# EAGLE design Data_East_128x16 (EAGLE 7.4.0)
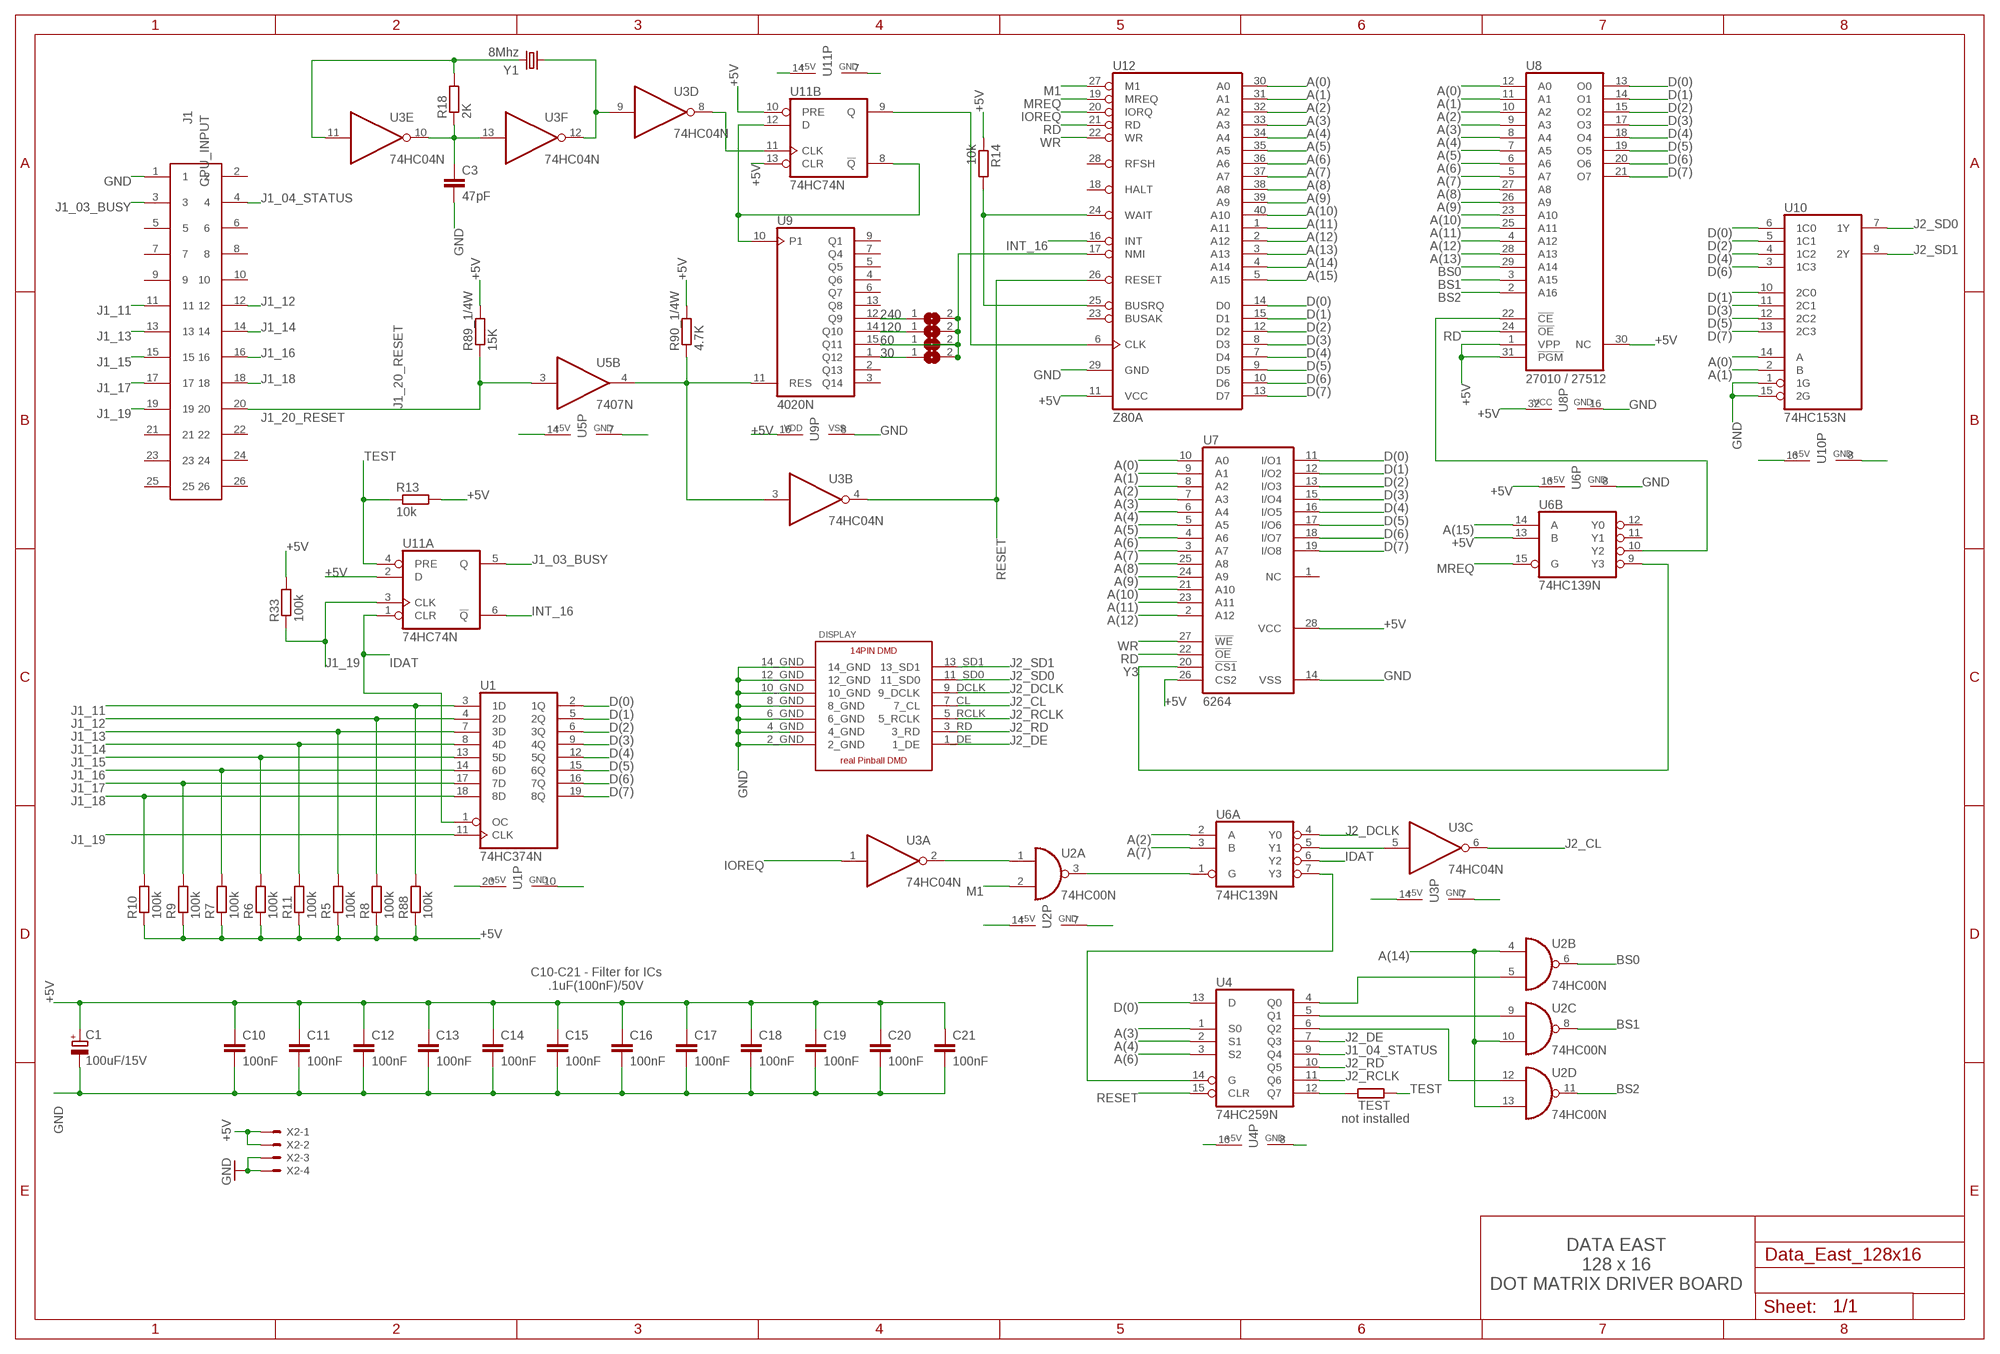
[diagram p0: schematic, sheet 1]

## Parts
C1  100uF/15V  CPOL-EUE2.5-7  [E2,5-7]
C3  47pF  C-EU050-025X075  [C050-025X075]
C10  100nF  C-EU050-025X075  [C050-025X075]
C11  100nF  C-EU050-025X075  [C050-025X075]
C12  100nF  C-EU050-025X075  [C050-025X075]
C13  100nF  C-EU050-025X075  [C050-025X075]
C14  100nF  C-EU050-025X075  [C050-025X075]
C15  100nF  C-EU050-025X075  [C050-025X075]
C16  100nF  C-EU050-025X075  [C050-025X075]
C17  100nF  C-EU050-025X075  [C050-025X075]
C18  100nF  C-EU050-025X075  [C050-025X075]
C19  100nF  C-EU050-025X075  [C050-025X075]
C20  100nF  C-EU050-025X075  [C050-025X075]
C21  100nF  C-EU050-025X075  [C050-025X075]
CPU_INPUT  J1  61202622323  [61202622323]
DISPLAY  PINBALL_DMD_HEADER_MALE  [14_PIN_DMD_MALE]
R5  100k  R-EU_0207/7  [0207/7]
R6  100k  R-EU_0207/7  [0207/7]
R7  100k  R-EU_0207/7  [0207/7]
R8  100k  R-EU_0207/7  [0207/7]
R9  100k  R-EU_0207/7  [0207/7]
R10  100k  R-EU_0207/7  [0207/7]
R11  100k  R-EU_0207/7  [0207/7]
R13  10k  R-EU_0207/7  [0207/7]
R14  10k  R-EU_0207/7  [0207/7]
R18  2K  R-EU_0207/7  [0207/7]
R33  100k  R-EU_0207/7  [0207/7]
R88  100k  R-EU_0207/7  [0207/7]
R89_1/4W  15K  R-EU_0207/7  [0207/7]
R90_1/4W  4.7K  R-EU_0207/7  [0207/7]
SJ2  SJ  [SJ]
SJ4  SJ  [SJ]
SJ5  SJ  [SJ]
SJ6  SJ  [SJ]
TEST  R-EU_0207/7  [0207/7]
U1  74HC374N  [DIL20]
U2  74HC00N  [DIL14]
U3  74HC04N  [DIL14]
U4  74HC259N  [DIL16]
U5  7407N  [DIL14]
U6  74HC139N  [DIL16]
U7  6264  6264A  [DIL28-6]
U8  27010 / 27512  27010  [DIL32]
U9  4020N  [DIL16]
U10  74HC153N  [DIL16]
U11  74HC74N  [DIL14]
U12  Z80A  Z80CPU  [DIL40]
X2  KK-156-4  [KK-156-4]
Y1  8Mhz  CRYSTALHC49U70  [HC49U70]

## Nets
30: SJ6.1 U9.1(Q12)
60: SJ2.2 SJ4.2 SJ5.1 SJ5.2 SJ6.2 U9.15(Q11) U12.17(NMI)
120: SJ4.1 U9.14(Q10)
240: SJ2.1 U9.12(Q9)
+5V: C1.+ C10.1 C11.1 C12.1 C13.1 C14.1 C15.1 C16.1 C17.1 C18.1 C19.1 C20.1 C21.1 R5.1 R6.1 R7.1 R8.1 R9.1 R10.1 R11.1 R13.2 R14.1 R33.2 R88.1 R89_1/4W.2 R90_1/4W.2 U1.20(VCC) U2.14(P:VCC) U3.14(P:VCC) U4.16(VCC) U5.14(P:VCC) U6.13(B:B) U6.16(P:VCC) U7.26(CS2) U7.28(VCC) U8.1(VPP) U8.30(NC) U8.31(!PGM) U8.32(VCC) U9.16(VDD) U10.16(VCC) U11.2(A:D) U11.10(B:PRE) U11.13(B:CLR) U11.14(P:VCC) U12.11(VCC) X2.1 X2.2
A(0): U7.10(A0) U8.12(A0) U10.14(A) U12.30(A0)
A(1): U7.9(A1) U8.11(A1) U10.2(B) U12.31(A1)
A(2): U6.2(A:A) U7.8(A2) U8.10(A2) U12.32(A2)
A(3): U4.1(S0) U7.7(A3) U8.9(A3) U12.33(A3)
A(4): U4.2(S1) U7.6(A4) U8.8(A4) U12.34(A4)
A(5): U7.5(A5) U8.7(A5) U12.35(A5)
A(6): U4.3(S2) U7.4(A6) U8.6(A6) U12.36(A6)
A(7): U6.3(A:B) U7.3(A7) U8.5(A7) U12.37(A7)
A(8): U7.25(A8) U8.27(A8) U12.38(A8)
A(9): U7.24(A9) U8.26(A9) U12.39(A9)
A(10): U7.21(A10) U8.23(A10) U12.40(A10)
A(11): U7.23(A11) U8.25(A11) U12.1(A11)
A(12): U7.2(A12) U8.4(A12) U12.2(A12)
A(13): U8.28(A13) U12.3(A13)
A(14): U2.4(B:I0) U2.10(C:I1) U2.13(D:I1) U12.4(A14)
A(15): U6.14(B:A) U12.5(A15)
BS0: U2.6(B:O) U8.29(A14)
BS1: U2.8(C:O) U8.3(A15)
BS2: U2.11(D:O) U8.2(A16)
D(0): U1.2(1Q) U4.13(D) U7.11(I/O1) U8.13(O0) U10.6(1C0) U12.14(D0)
D(1): U1.5(2Q) U7.12(I/O2) U8.14(O1) U10.10(2C0) U12.15(D1)
D(2): U1.6(3Q) U7.13(I/O3) U8.15(O2) U10.5(1C1) U12.12(D2)
D(3): U1.9(4Q) U7.15(I/O4) U8.17(O3) U10.11(2C1) U12.8(D3)
D(4): U1.12(5Q) U7.16(I/O5) U8.18(O4) U10.4(1C2) U12.7(D4)
D(5): U1.15(6Q) U7.17(I/O6) U8.19(O5) U10.12(2C2) U12.9(D5)
D(6): U1.16(7Q) U7.18(I/O7) U8.20(O6) U10.3(1C3) U12.10(D6)
D(7): U1.19(8Q) U7.19(I/O8) U8.21(O7) U10.13(2C3) U12.13(D7)
GND: C1.- C3.2 C10.2 C11.2 C12.2 C13.2 C14.2 C15.2 C16.2 C17.2 C18.2 C19.2 C20.2 C21.2 CPU_INPUT.1 DISPLAY.2_GND DISPLAY.4_GND DISPLAY.6_GND DISPLAY.8_GND DISPLAY.10_GND DISPLAY.12_GND DISPLAY.14_GND U1.10(GND) U2.7(P:GND) U3.7(P:GND) U4.8(GND) U5.7(P:GND) U6.8(P:GND) U7.14(VSS) U8.16(GND) U9.8(VSS) U10.1(1G) U10.8(GND) U10.15(2G) U11.7(P:GND) U12.29(GND) X2.3 X2.4
IDAT: U1.1(OC) U6.6(A:Y2) U11.1(A:CLR)
INT_16: U11.6(A:!Q) U12.16(INT)
IOREQ: U3.1(A:I) U12.20(IORQ)
J1_03_BUSY: CPU_INPUT.3 U11.5(A:Q)
J1_04_STATUS: CPU_INPUT.4 U4.9(Q4)
J1_11: CPU_INPUT.11 R88.2 U1.3(1D)
J1_12: CPU_INPUT.12 R8.2 U1.4(2D)
J1_13: CPU_INPUT.13 R5.2 U1.7(3D)
J1_14: CPU_INPUT.14 R11.2 U1.8(4D)
J1_15: CPU_INPUT.15 R6.2 U1.13(5D)
J1_16: CPU_INPUT.16 R7.2 U1.14(6D)
J1_17: CPU_INPUT.17 R9.2 U1.17(7D)
J1_18: CPU_INPUT.18 R10.2 U1.18(8D)
J1_19: CPU_INPUT.19 R33.1 U1.11(CLK) U11.3(A:CLK)
J1_20_RESET: CPU_INPUT.20 R89_1/4W.1 U5.3(B:I)
J2_CL: DISPLAY.7_CL U3.6(C:O)
J2_DCLK: DISPLAY.9_DCLK U6.4(A:Y0)
J2_DE: DISPLAY.1_DE U4.7(Q3)
J2_RCLK: DISPLAY.5_RCLK U4.11(Q6)
J2_RD: DISPLAY.3_RD U4.10(Q5)
J2_SD0: DISPLAY.11_SD0 U10.7(1Y)
J2_SD1: DISPLAY.13_SD1 U10.9(2Y)
M1: U2.2(A:I1) U12.27(M1)
MREQ: U6.15(B:G) U12.19(MREQ)
N$1: C3.1 R18.1 U3.10(E:O) U3.13(F:I)
N$2: R18.2 U3.11(E:I) Y1.2
N$3: U3.9(D:I) U3.12(F:O) Y1.1
N$4: TEST.2 U4.12(Q7)
N$5: U3.8(D:O) U11.11(B:CLK)
N$6: U9.10(P1) U11.8(B:!Q) U11.12(B:D)
N$7: R90_1/4W.1 U3.3(B:I) U5.4(B:O) U9.11(RES)
N$8: U11.9(B:Q) U12.6(CLK)
N$9: R14.2 U12.24(WAIT) U12.25(BUSRQ)
N$11: U3.5(C:I) U6.5(A:Y1)
N$12: U2.5(B:I1) U4.4(Q0)
N$13: U2.1(A:I0) U3.2(A:O)
N$14: U2.3(A:O) U6.1(A:G)
N$15: U2.9(C:I0) U4.5(Q1)
N$16: U4.14(G) U6.7(A:Y3)
N$18: U2.12(D:I0) U4.6(Q2)
N$35: U6.10(B:Y2) U8.22(!CE)
RD: U7.22(!OE) U8.24(!OE) U12.21(RD)
RESET: U3.4(B:O) U4.15(CLR) U12.26(RESET)
TEST: R13.1 TEST.1 U11.4(A:PRE)
WR: U7.27(!WE) U12.22(WR)
Y3: U6.9(B:Y3) U7.20(!CS1)
Unconnected: CPU_INPUT.2 CPU_INPUT.5 CPU_INPUT.6 CPU_INPUT.7 CPU_INPUT.8 CPU_INPUT.9 CPU_INPUT.10 CPU_INPUT.21 CPU_INPUT.22 CPU_INPUT.23 CPU_INPUT.24 CPU_INPUT.25 CPU_INPUT.26 U5.1(A:I) U5.2(A:O) U5.5(C:I) U5.6(C:O) U5.8(D:O) U5.9(D:I) U5.10(E:O) U5.11(E:I) U5.12(F:O) U5.13(F:I) U6.11(B:Y1) U6.12(B:Y0) U7.1(NC) U9.2(Q13) U9.3(Q14) U9.4(Q6) U9.5(Q5) U9.6(Q7) U9.7(Q4) U9.9(Q1) U9.13(Q8) U12.18(HALT) U12.23(BUSAK) U12.28(RFSH)

## Notes on the sheet
- C10-C21 - Filter for ICs
  .1uF(100nF)/50V
- not installed
- DATA EAST
  128 x 16
  DOT MATRIX DRIVER BOARD

## Library data of the parts
C1 = rcl:CPOL-EU: POLARIZED CAPACITOR, European symbol
C3 C10-C21 = resistor:C-EU: CAPACITOR, European symbol
CPU_INPUT = Wuerth_Elektronik_eiCan_05_Box_Header_IDC_Connectors_1_2:61202622323: WR-BHD 2.54mm Board to Cable Transition Connector, 26 Pins
DISPLAY = zzz_Sascha:PINBALL_DMD_HEADER: Pinball DMD Header 14PIN Created 21.10.2015 by DIY Sascha Header zum Anschluss eines Original Pinball DMD mit 14 Pins Port = HUB07 ENJOY!
R5-R11 R13 R14 R18 R33 R88 R89_1/4W R90_1/4W TEST = resistor:R-EU_: RESISTOR, European symbol
SJ2 SJ4-SJ6 = jumper:SJ: SMD solder JUMPER
U1 = 74xx-eu:74*374: Octal D type transparent LATCH, edge triggered
U2 = 74xx-eu:74*00: Quad 2-input NAND gate
U3 = 74xx-eu:74*04: Hex INVERTER
U4 = 74xx-eu:74*259: 8-bit addressable LATCH
U5 = 74xx-eu:74*07: Hex BUFFER, open collector high-voltage output
U6 = 74xx-eu:74*139: Dual 2-line to 4-line DECODER/DEMULTIPLEXER
U7 = memory-hitachi:6264A: MEMORY; OC_FARNELL: 283605; OC_NEWARK: unknown
U8 = memory:27010: MEMORY
U9 = 40xx:4020: 14-stage binary/ripple COUNTER
U10 = 74xx-eu:74*153: Dual 4-line to 1-line data SELECTOR/MULTIPLEXER
U11 = 74xx-eu:74*74: Dual D type positive edge triggered FLIP FLOP, preset and clear
U12 = zilog:Z80CPU: Z80 FAMILY DEVICE
X2 = con-molex:KK-156-4: KK 156 HEADER Source: http://www.molex.com/pdm_docs/sd/026604100_sd.pdf; OC_FARNELL: unknown; OC_NEWARK: unknown
Y1 = crystal:CRYSTAL: CRYSTAL; OC_FARNELL: unknown; OC_NEWARK: unknown

## Board
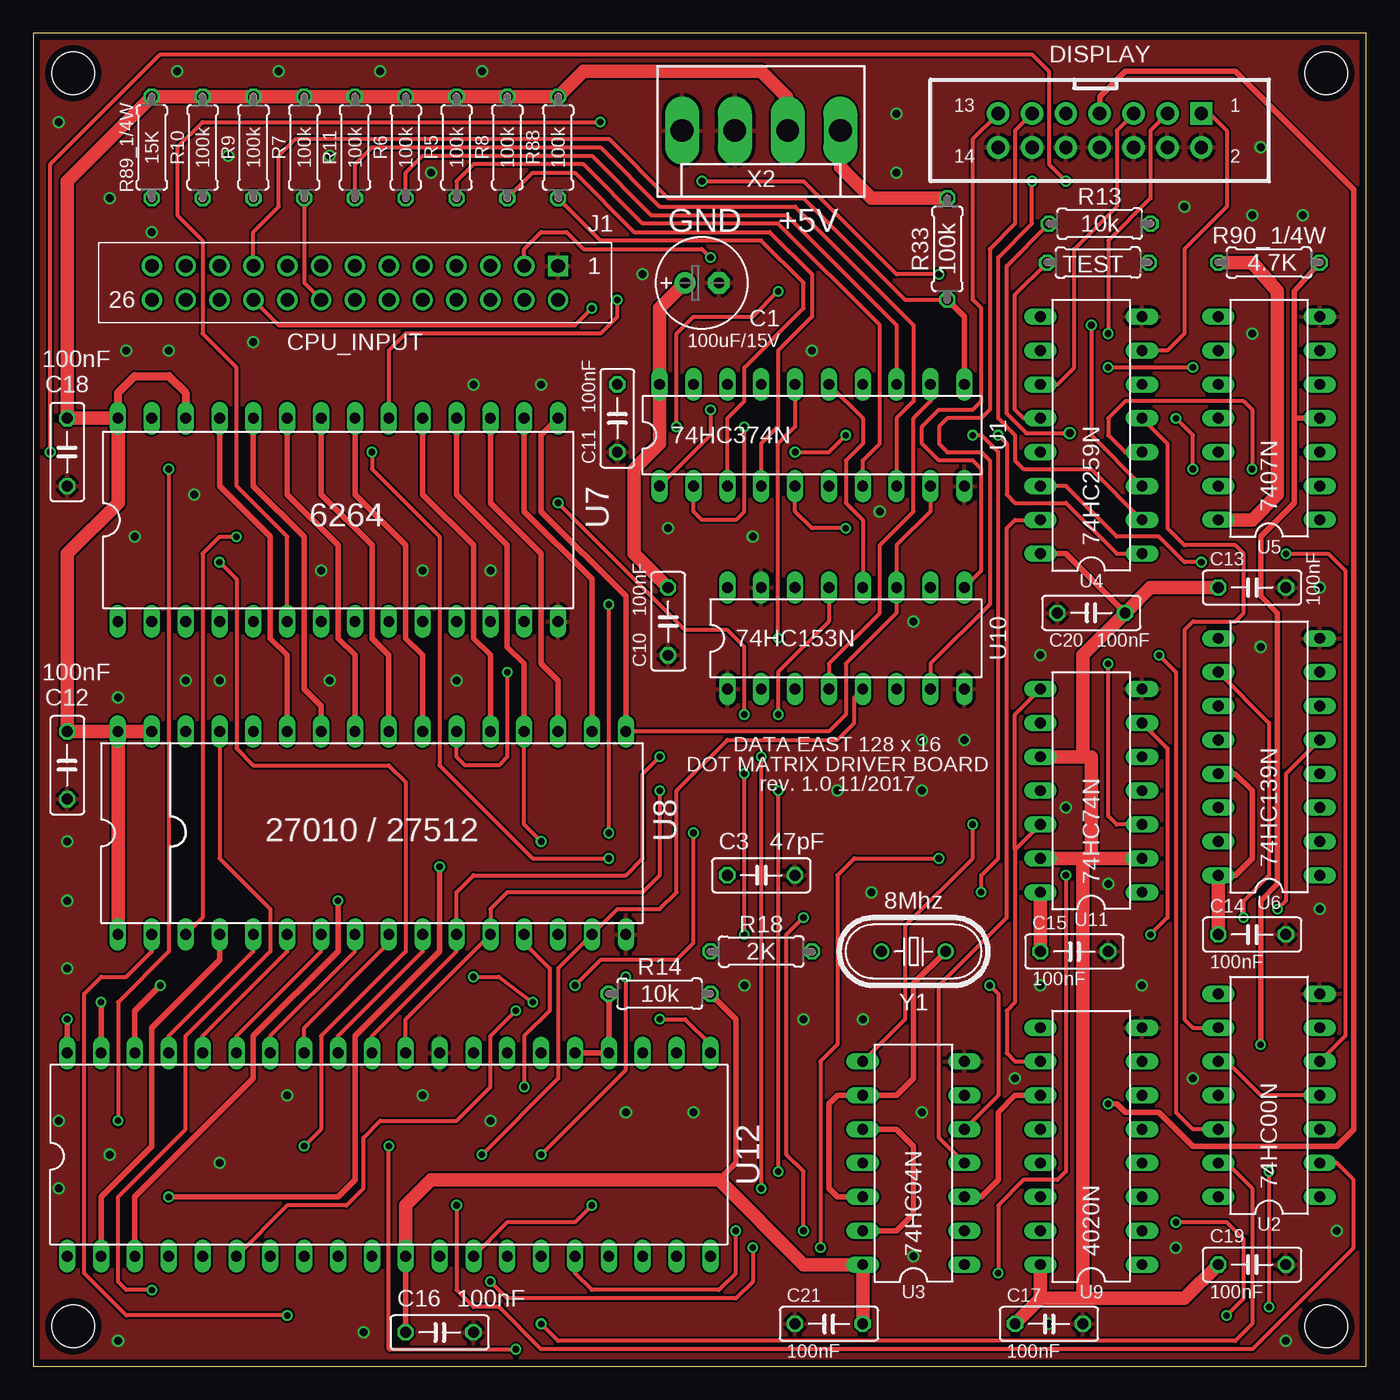
[diagram p1: board, top side]
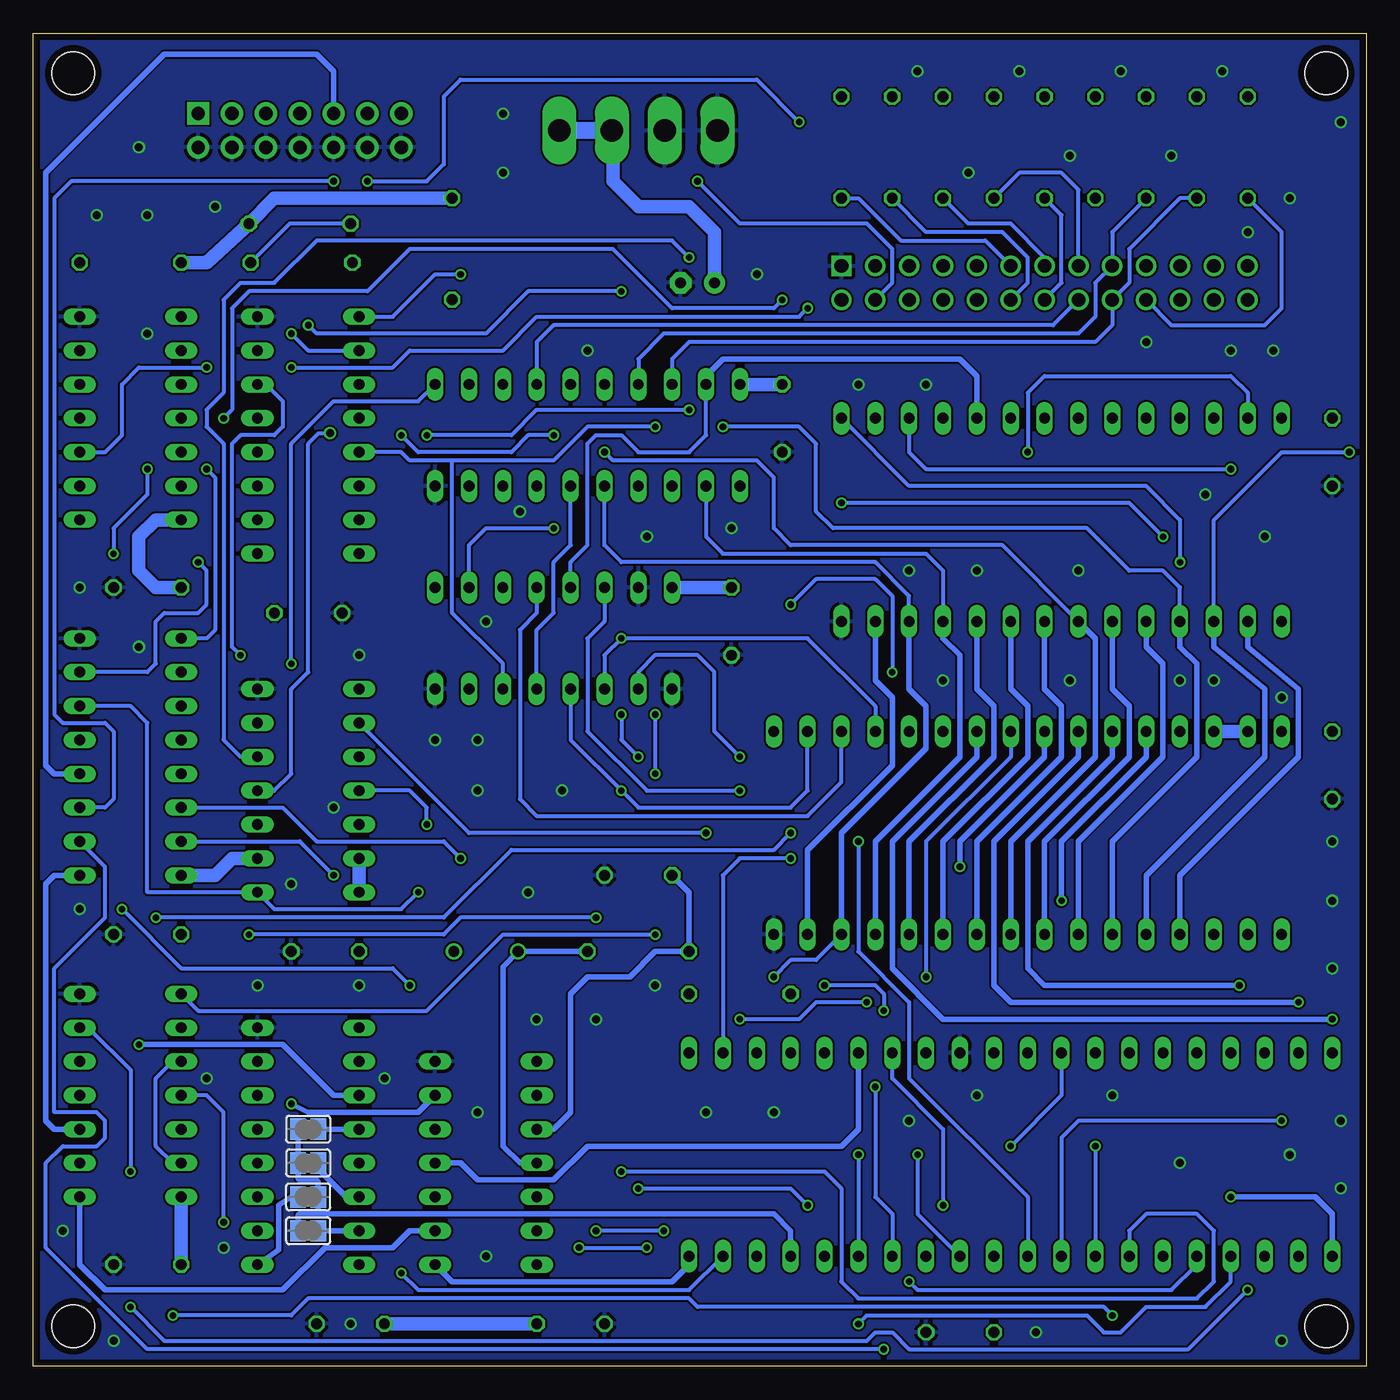
[diagram p2: board, bottom side, seen from below]

Size 100 x 100 mm. Coordinates in mm from the lower left corner, seen from the top.
Outline: 0,0 100,0 100,100 0,100 0,0
Copper layers (1*16): Top 0.035mm / dielectric 1.6mm / Bottom 0.035mm
Design rules "Elecrow_2-layer_PCB_eagle_rule_NAME": minimum track width 6mil, minimum drill 12mil, track to track 6mil, track to pad 6mil, pad to pad 6mil, via to via 8mil, smd to smd 0mil, copper to edge 20mil, drill to drill 10mil, minimum pad ring 6mil, minimum via ring 6mil, stop-mask expansion 0mil, vias tented up to drill 100mil, thermal gap 10mil
Holes 3.2 mm at 3,3 97,3 97,97 3,97

### Footprints (pad centres in the part's own frame; a part is rotated, then mirrored left to right if it is on the bottom)
E2,5-7 = drill 0.813 pad 1.6: + -1.27,0 | drill 0.813 pad 1.6 octagon: - 1.27,0
C050-025X075 = drill 0.813 octagon: 1 -2.54,0; 2 2.54,0
61202622323 = drill 1.02 square: 1 -2.54,-1.27 | drill 1.02: 2 -2.54,1.27; 3 0,-1.27; 4 0,1.27; 5 2.54,-1.27; 6 2.54,1.27; 7 5.08,-1.27; 8 5.08,1.27; 9 7.62,-1.27; 10 7.62,1.27; 11 10.16,-1.27; 12 10.16,1.27; 13 12.7,-1.27; 14 12.7,1.27; 15 15.24,-1.27; 16 15.24,1.27; 17 17.78,-1.27; 18 17.78,1.27; 19 20.32,-1.27; 20 20.32,1.27; 21 22.86,-1.27; 22 22.86,1.27; 23 25.4,-1.27; 24 25.4,1.27; 25 27.94,-1.27; 26 27.94,1.27
14_PIN_DMD_MALE = drill 1 pad 1.676 square: 1_DE 15.24,2.54 | drill 1 pad 1.676: 2_GND 15.24,0; 3_RD 12.7,2.54; 4_GND 12.7,0; 5_RCLK 10.16,2.54; 6_GND 10.16,0; 7_CL 7.62,2.54; 8_GND 7.62,0; 9_DCLK 5.08,2.54; 10_GND 5.08,0; 11_SD0 2.54,2.54; 12_GND 2.54,0; 13_SD1 0,2.54; 14_GND 0,0
0207/7 = drill 0.813 octagon: 1 -3.81,0; 2 3.81,0
SJ = smd 1.168 x 1.6: 1 -0.762,0; 2 0.762,0
DIL20 = drill 0.813 long: 1 -11.43,-3.81; 2 -8.89,-3.81; 3 -6.35,-3.81; 4 -3.81,-3.81; 5 -1.27,-3.81; 6 1.27,-3.81; 7 3.81,-3.81; 8 6.35,-3.81; 9 8.89,-3.81; 10 11.43,-3.81; 11 11.43,3.81; 12 8.89,3.81; 13 6.35,3.81; 14 3.81,3.81; 15 1.27,3.81; 16 -1.27,3.81; 17 -3.81,3.81; 18 -6.35,3.81; 19 -8.89,3.81; 20 -11.43,3.81
DIL14 = drill 0.813 long: 1 -7.62,-3.81; 2 -5.08,-3.81; 3 -2.54,-3.81; 4 0,-3.81; 5 2.54,-3.81; 6 5.08,-3.81; 7 7.62,-3.81; 8 7.62,3.81; 9 5.08,3.81; 10 2.54,3.81; 11 0,3.81; 12 -2.54,3.81; 13 -5.08,3.81; 14 -7.62,3.81
DIL16 = drill 0.813 long: 1 -8.89,-3.81; 2 -6.35,-3.81; 3 -3.81,-3.81; 4 -1.27,-3.81; 5 1.27,-3.81; 6 3.81,-3.81; 7 6.35,-3.81; 8 8.89,-3.81; 9 8.89,3.81; 10 6.35,3.81; 11 3.81,3.81; 12 1.27,3.81; 13 -1.27,3.81; 14 -3.81,3.81; 15 -6.35,3.81; 16 -8.89,3.81
DIL28-6 = drill 0.813 long: 1 -16.51,-7.62; 2 -13.97,-7.62; 3 -11.43,-7.62; 4 -8.89,-7.62; 5 -6.35,-7.62; 6 -3.81,-7.62; 7 -1.27,-7.62; 8 1.27,-7.62; 9 3.81,-7.62; 10 6.35,-7.62; 11 8.89,-7.62; 12 11.43,-7.62; 13 13.97,-7.62; 14 16.51,-7.62; 15 16.51,7.62; 16 13.97,7.62; 17 11.43,7.62; 18 8.89,7.62; 19 6.35,7.62; 20 3.81,7.62; 21 1.27,7.62; 22 -1.27,7.62; 23 -3.81,7.62; 24 -6.35,7.62; 25 -8.89,7.62; 26 -11.43,7.62; 27 -13.97,7.62; 28 -16.51,7.62
DIL32 = drill 0.813 long: 1 -19.05,-7.62; 2 -16.51,-7.62; 3 -13.97,-7.62; 4 -11.43,-7.62; 5 -8.89,-7.62; 6 -6.35,-7.62; 7 -3.81,-7.62; 8 -1.27,-7.62; 9 1.27,-7.62; 10 3.81,-7.62; 11 6.35,-7.62; 12 8.89,-7.62; 13 11.43,-7.62; 14 13.97,-7.62; 15 16.51,-7.62; 16 19.05,-7.62; 17 19.05,7.62; 18 16.51,7.62; 19 13.97,7.62; 20 11.43,7.62; 21 8.89,7.62; 22 6.35,7.62; 23 3.81,7.62; 24 1.27,7.62; 25 -1.27,7.62; 26 -3.81,7.62; 27 -6.35,7.62; 28 -8.89,7.62; 29 -11.43,7.62; 30 -13.97,7.62; 31 -16.51,7.62; 32 -19.05,7.62
DIL40 = drill 0.813 long: 1 -24.13,-7.62; 2 -21.59,-7.62; 3 -19.05,-7.62; 4 -16.51,-7.62; 5 -13.97,-7.62; 6 -11.43,-7.62; 7 -8.89,-7.62; 8 -6.35,-7.62; 9 -3.81,-7.62; 10 -1.27,-7.62; 11 1.27,-7.62; 12 3.81,-7.62; 13 6.35,-7.62; 14 8.89,-7.62; 15 11.43,-7.62; 16 13.97,-7.62; 17 16.51,-7.62; 18 19.05,-7.62; 19 21.59,-7.62; 20 24.13,-7.62; 21 24.13,7.62; 22 21.59,7.62; 23 19.05,7.62; 24 16.51,7.62; 25 13.97,7.62; 26 11.43,7.62; 27 8.89,7.62; 28 6.35,7.62; 29 3.81,7.62; 30 1.27,7.62; 31 -1.27,7.62; 32 -3.81,7.62; 33 -6.35,7.62; 34 -8.89,7.62; 35 -11.43,7.62; 36 -13.97,7.62; 37 -16.51,7.62; 38 -19.05,7.62; 39 -21.59,7.62; 40 -24.13,7.62
KK-156-4 = drill 1.7 pad 2.184 long: 1 -5.94,0; 2 -1.98,0; 3 1.98,0; 4 5.94,0
HC49U70 = drill 0.813: 1 -2.413,0; 2 2.413,0

### Placement (x,y rotation side)
C1  50.16,81.28 0 top
C3  54.61,36.83 0 top
C10  47.62,55.88 270 top
C11  43.81,71.12 270 top
C12  2.54,45.09 270 top
C13  91.44,58.42 0 top
C14  91.44,32.38 0 top
C15  78.11,31.11 0 top
C16  30.48,2.54 0 top
C17  76.2,3.17 0 top
C18  2.54,68.58 270 top
C19  91.44,7.62 0 top
C20  79.38,56.52 180 top
C21  59.69,3.17 180 top
CPU_INPUT  36.83,81.28 180 top
DISPLAY  72.39,91.44 0 top
R5  31.75,91.44 270 top
R6  27.94,91.44 270 top
R7  20.32,91.44 270 top
R8  35.56,91.44 270 top
R9  16.51,91.44 270 top
R10  12.7,91.44 270 top
R11  24.13,91.44 270 top
R13  80.01,85.72 0 top
R14  46.99,27.94 180 top
R18  54.61,31.11 0 top
R33  68.58,83.82 90 top
R88  39.37,91.44 270 top
R89_1/4W  8.89,91.44 90 top
R90_1/4W  92.71,82.8 180 top
SJ2  79.38,17.78 180 bottom
SJ4  79.38,15.24 180 bottom
SJ5  79.38,10.16 0 bottom
SJ6  79.38,12.7 0 bottom
TEST  79.88,82.8 180 top
U1  58.42,69.85 0 top
U2  92.71,20.32 90 top
U3  66.04,15.24 90 top
U4  79.38,69.85 90 top
U5  92.71,71.12 90 top
U6  92.71,45.72 90 top
U7  22.86,63.5 0 top
U8  25.4,40.01 0 top
U9  79.38,16.51 90 top
U10  60.96,54.61 0 top
U11  79.38,43.18 90 top
U12  26.67,15.88 0 top
X2  54.61,92.71 180 top
Y1  66.04,31.11 180 top

### Tracks (layer width: path | path; a pad name or v marks a point on that pad's centre or on a via)
30
  Bottom 0.406: SJ6.1 80.64,12.7 81.6,12.06 81.6,8.73 U9.1
60
  Bottom 0.406: U12.17 43.18,10.16 44.45,11.43 78.74,11.43 | 78.74,11.43 80.01,11.43 80.14,11.3 SJ5.1 SJ5.2 U9.15 | SJ2.2 SJ4.2 80.14,14.1 80.01,13.97 78.74,13.97 78.61,13.84 SJ6.2 78.61,11.56 78.74,11.43
120
  Bottom 0.406: U9.14 76.52,12.7 78.58,14.76 78.58,15.21 SJ4.1
240
  Bottom 0.406: SJ2.1 U9.12
+5V
  Top 0.406: C16.1 U12.11 | U4.16 77.47,60.96 C20.1 | U6.16 90.17,36.83 91.44,38.1 91.44,43.18 90.17,44.45 U6.13 | R14.1 52.7,26.04 52.7,15.24 51.44,13.97
  Top 0.61: U7.28 6.35,73.03 7.62,74.3 10.16,74.3 11.43,73.03 U7.26
  Top 1.016: U8.32 C12.1 2.54,60.96 6.35,64.77 U7.28 C18.1 2.54,88.9 R89_1/4W.2 R10.1 R9.1 R7.1 R11.1 R6.1 R5.1 R8.1 R88.1 41.27,97.16 54.61,97.16 56.52,95.25 56.52,92.78 X2.2 | U8.32 U8.1 | U8.32 U8.31 | R33.2 62.87,87.63 60.55,89.94 X2.1 | C1.+ 46.99,79.38 U1.20 46.99,69.22 45.09,67.31 45.09,60.96 C10.1 | U12.11 27.94,12.06 29.84,13.97 51.44,13.97 57.78,7.62 U3.14 C21.1 | C17.1 75.56,5.08 | 75.56,5.08 U9.16 | C19.1 86.36,5.08 78.74,5.08 | 78.74,5.08 75.56,5.08 | C15.1 U11.14 | U11.2 79.38,38.1 | 78.74,38.1 U11.13 | C14.1 U6.16 | U11.10 78.74,45.72 | 79.38,38.1 79.38,45.72 78.74,45.72 | 79.38,38.1 78.74,38.1 | 78.74,45.72 78.74,53.34 C20.1 83.82,58.42 C13.1 | U5.14 91.44,63.5 93.34,65.41 93.34,80.64 91.44,82.8 R90_1/4W.2 | 78.74,38.1 78.74,5.08
  Bottom 1.016: C11.1 U1.20 | C10.1 U10.16 | C21.1 C17.1 | C19.1 U2.14 | U11.13 U11.14 | C13.1 90.81,58.42 92.08,59.69 92.08,62.23 90.81,63.5 U5.14 | R33.2 81.92,87.63 R13.2 87,82.8 R90_1/4W.2 | U11.2 85.09,38.1 86.36,36.83 U6.16 | C1.+ 48.9,85.09 50.8,87 54.61,87 56.52,88.9 56.52,92.64 X2.2 | U8.31 U8.30
  Bottom 1.27: X2.2 X2.1
A(0)  (via drill 0.5)
  Top 0.305: v46.99,43.18 46.99,36.83 45.72,35.56 35.56,35.56 34.29,34.29 U8.12 27.94,26.04 U12.30
  Bottom 0.305: U10.14 57.15,55.88 58.42,54.61 58.42,47.62 53.98,43.18 v46.99,43.18
  Bottom 0.406: U8.12 34.29,39.37 27.94,45.72 27.94,49.53 29.21,50.8 U7.10
A(1)  (via drill 0.5)
  Top 0.305: v46.99,45.72 45.72,44.45 45.72,38.1 44.45,36.83 33.02,36.83 31.75,35.56 U8.11 31.75,31.11 25.4,24.77 U12.31
  Bottom 0.305: U10.2 54.61,52.07 53.34,53.34 50.16,53.34 48.9,52.07 48.9,47.62 v46.99,45.72
  Bottom 0.406: U8.11 31.75,39.37 25.4,45.72 25.4,49.53 26.67,50.8 U7.9
A(2)  (via drill 0.5)
  Top 0.305: v36.2,1.27 26.67,1.27 v26.67,16.51 | U12.32 22.86,24.77 29.21,31.11 U8.10
  Bottom 0.305: U6.2 94.61,37.47 94.61,33.66 98.42,29.84 98.42,19.05 95.25,19.05 94.61,18.41 94.61,17.14 95.25,16.51 97.79,16.51 99.06,15.24 99.06,8.89 91.44,1.27 v36.2,1.27 | U12.32 22.86,20.32 v26.67,16.51
  Bottom 0.406: U8.10 29.21,39.37 22.86,45.72 22.86,49.53 24.13,50.8 U7.8
A(3)  (via drill 0.5)
  Top 0.305: v57.15,68.58 59.69,68.58 v60.96,69.85 | v72.39,69.85 73.03,69.22 73.03,65.41 73.66,64.77 77.47,64.77 81.28,60.96 U4.1 | U12.33 20.32,25.4 26.67,31.75 U8.9
  Bottom 0.305: v57.15,68.58 56.52,67.94 45.72,67.94 44.45,66.67 44.45,62.87 43.18,61.59 27.3,61.59 U7.7 | v60.96,69.85 62.87,69.85 64.14,68.58 71.12,68.58 v72.39,69.85
  Bottom 0.406: U8.9 26.67,39.37 20.32,45.72 20.32,54.61 U7.7
A(4)  (via drill 0.5)
  Top 0.305: U4.2 79.38,67.31 74.3,67.31 73.66,67.94 73.66,69.85 72.39,71.12 72.39,83.19 74.93,85.72 v74.93,88.9 | U7.6 19.05,62.23 15.24,66.04 15.24,74.93 12.7,77.47 12.7,84.45 10.79,86.36 10.79,91.44 12.7,93.34 v42.55,93.34 | U12.34 17.78,24.77 24.13,31.11 U8.8
  Bottom 0.305: v42.55,93.34 45.72,96.52 67.94,96.52 69.22,95.25 69.22,90.17 70.48,88.9 v74.93,88.9
  Bottom 0.406: U7.6 19.05,50.8 17.78,49.53 17.78,45.72 24.13,39.37 U8.8
A(5)
  Top 0.305: U12.35 15.24,24.77 21.59,31.11 U8.7
  Bottom 0.406: U7.5 16.51,53.98 15.24,52.7 15.24,45.72 21.59,39.37 U8.7
A(6)  (via drill 0.5)
  Top 0.305: U4.3 79.38,69.85 v79.38,78.11 | v48.26,70.48 48.26,77.47 49.53,78.74 53.98,78.74 v55.88,80.64 | U12.36 12.7,24.77 19.05,31.11 U8.6
  Bottom 0.305: U7.4 13.97,58.42 15.24,59.69 17.78,59.69 20.95,62.87 40.01,62.87 41.27,64.14 41.27,69.22 42.55,70.48 v48.26,70.48 | v55.88,80.64 62.87,80.64 66.04,77.47 78.74,77.47 v79.38,78.11
  Bottom 0.406: U7.4 13.97,53.98 12.7,52.7 12.7,45.72 19.05,39.37 U8.6
A(7)  (via drill 0.5)
  Top 0.305: v77.47,88.9 76.2,90.17 76.2,97.16 74.93,98.42 9.53,98.42 1.27,90.17 v1.27,68.58 | U12.37 10.16,24.77 16.51,31.11 U8.5
  Bottom 0.305: U6.3 94.61,41.91 93.98,42.55 93.98,47.62 94.61,48.26 97.79,48.26 98.42,48.9 98.42,87.63 97.16,88.9 v77.47,88.9 | U7.3 11.43,63.5 6.35,68.58 v1.27,68.58
  Bottom 0.406: U7.3 11.43,53.98 7.62,50.8 7.62,45.72 16.51,36.83 U8.5
A(8)  (via drill 0.5)
  Top 0.406: U8.27 19.05,53.34 17.78,54.61 17.78,62.23 13.97,66.04 U7.25 | U12.38 7.62,26.67 v9.53,28.57
  Bottom 0.406: U8.27 19.05,45.72 25.4,39.37 25.4,29.84 24.13,28.57 v9.53,28.57
A(9)  (via drill 0.5)
  Top 0.406: U7.24 16.51,66.04 20.32,62.23 20.32,50.8 21.59,49.53 U8.26 | U12.39 v5.08,27.3
  Bottom 0.406: U8.26 21.59,45.72 27.94,39.37 27.94,28.57 26.67,27.3 v5.08,27.3
A(10)  (via drill 0.5)
  Top 0.406: U7.21 24.13,65.41 27.94,61.59 27.94,54.61 29.21,53.34 U8.23 | U12.40 v2.54,26.04
  Bottom 0.406: U8.23 29.21,45.72 35.56,39.37 35.56,29.84 31.75,26.04 v2.54,26.04
A(11)  (via drill 0.5)
  Top 0.406: U7.23 19.05,65.41 22.86,61.59 22.86,54.61 24.13,53.34 U8.25 | v30.48,37.47 30.48,31.11 24.13,24.77 24.13,13.97 22.86,12.7 v10.16,12.7
  Bottom 0.406: U8.25 24.13,45.72 30.48,39.37 v30.48,37.47 | v10.16,12.7 3.81,12.7 2.54,11.43 U12.1
A(12)
  Top 0.406: U12.2 5.08,12.7 8.89,16.51 8.89,25.4 13.97,30.48 U8.4
  Bottom 0.406: U7.2 8.89,53.98 5.08,50.8 5.08,45.72 13.97,36.83 U8.4
A(13)  (via drill 0.5)
  Top 0.406: U12.3 7.62,12.7 16.51,21.59 16.51,24.77 22.86,31.11 v22.86,34.92
  Bottom 0.406: U8.28 16.51,45.72 22.86,39.37 v22.86,34.92
A(14)  (via drill 0.5)
  Top 0.305: v38.1,3.17 39.37,1.91 90.17,1.91 91.44,3.17 91.44,13.34 89.53,15.24 U2.13 | U2.4 92.08,20.32 89.53,22.86 U2.10
  Bottom 0.305: v38.1,3.17 37.47,3.81 20.95,3.81 19.68,2.54 18.41,2.54 16.51,4.45 12.06,4.45 10.16,6.35 U12.4 | U2.13 89.53,15.24 90.81,16.51 90.81,21.59 89.53,22.86 U2.10
A(15)  (via drill 0.5)
  Top 0.305: v34.29,6.35 35.56,5.08 52.7,5.08 53.98,6.35 v53.98,8.89 | v59.05,8.89 59.05,22.86 60.33,24.13 60.33,36.83 61.59,38.1 v67.94,38.1
  Bottom 0.305: U12.5 12.7,7.62 14.61,5.71 33.66,5.71 v34.29,6.35 | v59.05,8.89 v53.98,8.89 | U6.14 81.28,41.91 78.74,39.37 69.22,39.37 v67.94,38.1
BS0  (via drill 0.5)
  Top 0.305: v8.89,5.71 6.99,5.71 6.35,6.35 6.35,12.7 11.43,17.78 11.43,24.77 17.78,31.11 17.78,34.29 13.97,38.1 U8.29 | v92.71,14.61 v92.71,4.45
  Bottom 0.305: v8.89,5.71 13.34,1.27 34.29,1.27 35.56,2.54 36.83,2.54 37.47,1.91 90.17,1.91 v92.71,4.45 | U2.6 95.89,25.4 92.71,22.23 v92.71,14.61
BS1  (via drill 0.5)
  Top 0.305: U8.3 12.7,33.66 12.7,60.96 13.97,62.23 v15.24,62.23 | v39.37,64.77 48.9,55.24 52.07,55.24 53.34,53.98 v53.34,48.9 | v53.34,32.38 v53.34,44.45
  Bottom 0.305: U2.8 87.63,26.67 70.48,26.67 64.77,32.38 v53.34,32.38 | v39.37,64.77 17.78,64.77 v15.24,62.23 | v53.34,48.9 v53.34,44.45
BS2  (via drill 0.5)
  Top 0.305: v19.05,3.81 6.99,3.81 3.81,6.99 3.81,27.94 5.08,29.21 6.99,29.21 8.89,31.11 U8.2 | v89.53,3.81 90.81,5.08 90.81,9.53 89.53,10.79 v85.72,10.79
  Bottom 0.305: v19.05,3.81 19.68,4.45 50.16,4.45 50.8,5.08 79.38,5.08 80.64,3.81 v89.53,3.81 | U2.11 87,20.32 85.72,19.05 v85.72,10.79
D(0)  (via drill 0.5)
  Top 0.305: U8.13 36.83,31.75 38.73,29.84 38.73,26.67 36.83,24.77 v36.83,20.95 | v53.34,70.48 53.34,64.14 52.7,63.5 50.16,63.5 49.53,64.14 U1.2
  Bottom 0.305: U10.6 64.77,52.7 68.58,56.52 68.58,67.94 | U1.2 49.53,62.23 48.26,60.96 33.02,60.96 31.75,59.69 U7.11 | v36.83,20.95 36.83,12.7 35.56,11.43 U12.14 | v53.34,70.48 58.42,70.48 60.96,67.94 68.58,67.94 | 68.58,67.94 71.75,67.94 72.39,68.58 U4.13
  Bottom 0.406: U8.13 36.83,39.37 30.48,45.72 30.48,53.34 31.75,54.61 U7.11
D(1)  (via drill 0.5)
  Top 0.305: v60.96,62.87 58.42,62.87 57.15,64.14 U1.5 | v38.1,15.88 44.45,22.23 v44.45,29.21
  Bottom 0.305: U7.12 34.29,57.78 36.83,60.33 55.88,60.33 57.15,61.59 U1.5 | U10.10 67.31,61.59 66.04,62.87 v60.96,62.87 | v38.1,15.88 U12.15 | U8.14 41.27,30.48 43.18,30.48 v44.45,29.21
  Bottom 0.406: U8.14 39.37,40.01 33.02,46.35 33.02,49.53 34.29,50.8 U7.12
D(2)  (via drill 0.5)
  Top 0.305: U10.5 61.59,50.16 61.59,48.26 60.33,46.99 52.07,46.99 48.26,43.18 48.26,35.56 46.99,34.29 43.81,34.29 U8.15 39.37,29.84 39.37,21.59 v33.66,15.88
  Bottom 0.305: U10.5 62.23,55.24 60.96,56.52 60.96,60.33 59.69,61.59 U1.6 | U12.12 33.66,11.43 v33.66,15.88
  Bottom 0.406: U8.15 41.91,38.73 35.56,45.09 35.56,50.16 36.83,51.44 U7.13
D(3)  (via drill 0.5)
  Top 0.305: U1.9 67.31,64.14 64.77,61.59 U10.11 64.77,56.52 60.96,52.7 60.96,48.9 59.69,47.62 U8.17 | v20.32,16.51 21.59,17.78 21.59,24.77 27.94,31.11 27.94,43.81 26.67,45.09 16.51,45.09 15.24,46.35 15.24,59.05 v13.97,60.33
  Top 0.406: U7.15 38.1,69.85 38.1,64.14 44.45,57.78 U8.17
  Bottom 0.305: v20.32,16.51 U12.8 | U7.15 34.29,66.04 16.51,66.04 13.97,63.5 v13.97,60.33
D(4)  (via drill 0.5)
  Top 0.305: U1.12 67.31,72.39 66.04,71.12 66.04,64.14 63.5,61.59 63.5,56.52 59.69,52.7 U10.4 | v55.88,43.18 v55.88,14.61
  Top 0.406: U7.16 36.83,64.14 41.91,59.05 U8.18
  Bottom 0.305: U10.4 59.69,46.99 v55.88,43.18 54.61,41.91 43.18,41.91 41.91,43.18 U8.18 | v55.88,14.61 40.64,14.61 39.37,13.34 39.37,6.35 38.1,5.08 12.7,5.08 11.43,6.35 11.43,10.16 12.7,11.43 16.51,11.43 17.78,10.16 U12.7
D(5)  (via drill 0.5)
  Top 0.305: U1.15 62.23,71.12 62.23,69.22 60.96,67.94 60.96,64.77 62.23,63.5 U10.12 | v6.35,18.41 6.35,27.3 10.16,31.11 v10.16,67.31
  Top 0.406: U7.17 34.29,64.77 38.1,60.96 38.1,52.7 39.37,51.44 U8.19
  Bottom 0.305: U10.12 62.23,56.52 63.5,55.24 63.5,42.55 62.23,41.27 41.91,41.27 39.37,43.81 U8.19 | U12.9 22.86,17.14 21.59,18.41 v6.35,18.41 | U7.17 34.29,68.58 33.02,67.31 v10.16,67.31
D(6)  (via drill 0.5)
  Top 0.305: U1.16 57.15,70.48 55.88,69.22 v55.88,54.61 | v38.1,39.37 36.83,40.64 U8.20
  Top 0.406: U7.18 31.75,65.41 35.56,61.59 35.56,53.98 36.83,52.7 U8.20
  Bottom 0.305: v38.1,39.37 38.1,31.11 34.29,27.3 34.29,21.59 25.4,12.7 U12.10 | U8.20 36.83,49.53 41.91,54.61 v55.88,54.61 57.15,53.34 U10.3
D(7)  (via drill 0.5)
  Top 0.305: U12.13 35.56,10.79 40.64,10.79 v41.91,12.06 | U10.13 59.69,55.88 55.88,52.07 v55.88,48.9 | v54.61,45.72 v54.61,13.34
  Top 0.406: U7.19 29.21,65.41 33.02,61.59 33.02,54.61 34.29,53.34 U8.21
  Bottom 0.305: U10.13 59.69,60.33 58.42,61.59 58.42,69.22 57.78,69.85 55.88,69.85 54.61,68.58 50.8,68.58 49.53,69.85 U1.19 | v41.91,12.06 43.18,13.34 v54.61,13.34 | v55.88,48.9 55.88,46.99 v54.61,45.72
  Bottom 0.406: U7.19 29.21,74.3 30.48,75.56 48.26,75.56 49.53,74.3 U1.19
GND  (via drill 0.6)
  other vias: 19.05,20.32 5.71,15.88 2.54,34.92 6.35,50.16 1.91,93.34 53.34,28.57 49.53,19.05 34.29,18.41 29.21,20.32 62.87,35.56 66.67,43.18 95.25,86.36 86.36,87 63.5,64.14 66.67,46.99 92.08,91.44 64.77,89.53 60.33,43.18 66.04,55.88 38.1,73.66 12.06,65.41 21.59,59.69 16.51,76.83 47.62,62.87 75.56,53.34 58.42,76.2 45.72,81.92 6.99,76.2 5.71,87.63 2.54,29.84 14.61,90.81 64.77,93.98 92.08,53.98 69.85,46.99 96.52,58.42 80.64,36.2 57.78,26.04 62.23,26.04 66.67,19.05 66.04,8.26 44.45,19.05 97.79,10.16 87,21.59 83.19,28.57 77.47,41.91 85.72,8.89 76.2,3.17 96.52,34.29 22.23,90.81 29.84,89.53 10.79,97.16 18.41,97.16 26.04,97.16 33.66,97.16 2.54,39.37 91.44,86.36 91.44,77.47 13.97,15.24 53.98,62.23 13.97,51.44 29.21,59.69 34.29,59.69 31.75,51.44 22.23,51.44 11.43,51.44 93.98,1.91 6.35,1.91 1.91,18.41 1.91,13.34 7.62,62.23 33.02,73.66 10.16,76.2 8.89,85.09 24.77,2.54 75.56,28.57 73.66,21.59
  pour Top: -0.64,100.33 100.33,100.33 100.97,-0.64 -0.64,-0.64
  pour Bottom: -0.64,100.33 100.33,100.33 100.97,-0.64 -0.64,-0.64
IDAT  (via drill 0.5)
  Top 0.305: v50.8,71.75 50.8,69.85 U1.1 | v71.12,35.56 71.12,36.83 72.39,38.1 72.39,68.58 71.12,69.85 v70.48,69.85
  Bottom 0.305: v50.8,71.75 62.23,71.75 64.14,69.85 v70.48,69.85 | U6.6 92.71,49.53 91.44,48.26 91.44,35.56 U11.1 81.92,34.29 72.39,34.29 v71.12,35.56
INT_16  (via drill 0.5)
  Top 0.305: U12.16 40.64,6.99 41.91,5.71 51.44,5.71 52.7,6.99 v52.7,10.16 | U11.6 85.09,46.35 85.09,33.66 v83.82,32.38 | v57.78,10.16 57.78,14.61 56.52,15.88 56.52,32.38 v57.78,33.66
  Bottom 0.305: v52.7,10.16 v57.78,10.16 | v57.78,33.66 67.94,33.66 69.22,32.38 v83.82,32.38
IOREQ
  Bottom 0.406: U3.1 68.58,6.35 52.07,6.35 50.8,7.62 U12.20
J1_03_BUSY  (via drill 0.5)
  Top 0.305: CPU_INPUT.3 36.83,83.82 38.1,85.09 40.01,85.09 41.27,83.82 50.16,83.82 v50.8,83.19
  Bottom 0.305: v50.8,83.19 52.07,84.45 78.74,84.45 81.92,81.28 84.45,81.28 85.72,80.01 85.72,73.03 87,71.75 87,70.48 85.72,69.22 85.72,46.99 84.45,45.72 U11.5
J1_04_STATUS  (via drill 0.5)
  Top 0.305: v67.94,81.92 64.77,81.92 57.78,88.9 v50.16,88.9
  Bottom 0.305: U4.9 73.03,78.74 69.85,81.92 v67.94,81.92 | v50.16,88.9 46.99,85.72 37.47,85.72 35.56,83.82 35.56,81.28 CPU_INPUT.4
J1_11
  Top 0.305: U1.3 52.07,71.12 53.34,72.39 53.34,74.93 57.78,79.38 57.78,81.28 54.61,84.45 42.55,84.45 R88.2
  Bottom 0.305: R88.2 38.1,87.63 34.92,84.45 28.57,84.45 CPU_INPUT.11
J1_12
  Top 0.305: R8.2 37.47,89.53 40.64,89.53 45.09,85.09 55.24,85.09 58.42,81.92 58.42,78.74 55.88,76.2 55.88,70.48 54.61,69.22 U1.4
  Bottom 0.305: CPU_INPUT.12 25.4,81.28 25.4,83.19 27.3,85.09 33.02,85.09 R8.2
J1_13
  Top 0.305: U1.7 62.23,67.94 63.5,69.22 63.5,78.11 55.88,85.72 45.72,85.72 41.27,90.17 33.02,90.17 31.75,88.9 R5.2
  Bottom 0.305: CPU_INPUT.13 24.13,83.19 26.67,85.72 29.84,85.72 R5.2
J1_14
  Top 0.305: R11.2 24.13,90.17 25.4,91.44 42.55,91.44 46.99,87 57.15,87 66.04,78.11 66.04,72.39 64.77,71.12 U1.8
  Bottom 0.305: CPU_INPUT.14 22.86,81.28 22.86,86.36 R11.2
J1_15
  Top 0.305: R6.2 27.94,89.53 29.21,90.81 41.91,90.81 46.35,86.36 56.52,86.36 64.77,78.11 U1.13
  Bottom 0.305: CPU_INPUT.15 21.59,88.27 22.86,89.53 26.04,89.53 R6.2
J1_16
  Top 0.305: R7.2 20.32,81.28 CPU_INPUT.16
  Bottom 0.305: CPU_INPUT.16 23.5,78.11 60.96,78.11 62.23,76.83 U1.14
J1_17
  Bottom 0.305: R9.2 19.05,85.09 CPU_INPUT.17 20.32,81.28 20.32,78.74 21.59,77.47 52.7,77.47 54.61,75.56 U1.17
J1_18
  Bottom 0.305: R10.2 13.97,87.63 17.78,83.82 17.78,81.28 CPU_INPUT.18 19.05,78.11 20.32,76.83 50.8,76.83 52.07,75.56 U1.18
J1_19  (via drill 0.5)
  Top 0.305: U11.3 81.28,40.64 80.64,41.27 v80.64,52.7 | CPU_INPUT.19 16.51,85.09 18.41,87 18.41,90.81 19.68,92.08 43.18,92.08 47.62,87.63 57.78,87.63 65.41,80.01 R33.1
  Top 0.406: U1.11 69.85,78.74 R33.1
  Bottom 0.305: v80.64,52.7 80.64,69.22 77.47,72.39 71.12,72.39 U1.11
J1_20_RESET  (via drill 0.5)
  Top 0.305: v87,74.93 v80.64,74.93 | CPU_INPUT.20 18.41,78.11 40.64,78.11 v41.91,79.38
  Bottom 0.305: U5.3 94.61,68.58 93.34,69.85 93.34,73.66 92.08,74.93 v87,74.93 | v80.64,74.93 73.03,74.93 71.75,76.2 64.77,76.2 62.23,78.74 42.55,78.74 v41.91,79.38 | CPU_INPUT.20 14.61,78.11 7.62,78.11 6.35,79.38 6.35,85.09 R89_1/4W.1
J2_CL  (via drill 0.5)
  Top 0.406: DISPLAY.7_CL 80.01,95.25 81.92,97.16 90.17,97.16 99.06,88.27 99.06,17.78 97.79,16.51 87,16.51 84.45,19.05 81.92,19.05 81.28,19.68 v80.64,19.68
  Bottom 0.406: U3.6 71.12,19.05 79.38,19.05 v80.64,19.68
J2_DCLK
  Bottom 0.406: U6.4 98.42,44.45 99.06,45.09 99.06,89.53 90.17,98.42 78.74,98.42 77.47,97.16 DISPLAY.9_DCLK
J2_DE
  Top 0.305: DISPLAY.1_DE 88.27,93.98 89.53,92.71 89.53,87 86.36,83.82 86.36,77.47 85.09,76.2 U4.7
J2_RCLK
  Top 0.305: DISPLAY.5_RCLK 81.28,92.71 81.28,87 78.11,83.82 78.11,74.93 76.83,73.66 U4.11
J2_RD  (via drill 0.5)
  Top 0.305: DISPLAY.3_RD 83.82,92.71 83.82,87.63 80.64,84.45 v80.64,77.47
  Bottom 0.305: v80.64,77.47 79.38,76.2 U4.10
J2_SD0
  Top 0.305: U10.7 67.31,52.7 71.75,57.15 71.75,67.94 71.12,68.58 68.58,68.58 67.94,69.22 67.94,70.48 68.58,71.12 71.12,71.12 71.75,71.75 71.75,83.82 73.66,85.72 73.66,92.71 DISPLAY.11_SD0
J2_SD1
  Top 0.305: U10.9 71.12,59.69 71.12,67.31 70.48,67.94 67.94,67.94 66.67,69.22 66.67,70.48 67.94,71.75 70.48,71.75 71.12,72.39 71.12,79.38 70.48,80.01 70.48,92.08 DISPLAY.13_SD1
M1  (via drill 0.5)
  Top 0.305: U2.2 97.79,15.24 99.06,13.97 99.06,8.89 91.44,1.27 38.1,1.27 34.92,4.45 33.02,4.45 31.75,5.71 v31.75,12.06
  Bottom 0.305: U12.27 35.56,21.59 31.75,17.78 v31.75,12.06
MREQ  (via drill 0.5)
  Top 0.305: v77.47,36.83 77.47,14.61 76.83,13.97 74.3,13.97 72.39,12.06 v72.39,6.99
  Bottom 0.305: U12.19 50.8,5.71 71.12,5.71 v72.39,6.99 | U6.15 80.01,39.37 v77.47,36.83
N$1
  Top 0.406: U3.13 64.77,10.16 66.04,11.43 66.04,16.51 64.77,17.78 U3.10
  Bottom 0.406: C3.1 50.8,35.56 R18.1 53.34,31.11 55.24,29.21 58.42,29.21 59.69,27.94 59.69,19.05 60.96,17.78 U3.10
N$2
  Bottom 0.406: U3.11 63.5,15.24 64.77,16.51 64.77,29.97 Y1.2 R18.2
N$3
  Top 0.406: Y1.1 66.04,28.7 66.04,21.59 64.77,20.32 U3.9 60.33,20.32 59.69,19.68 59.69,13.34 60.33,12.7 U3.12
N$4
  Top 0.305: U4.12 74.3,71.12 73.66,71.75 73.66,80.39 TEST.2
N$5  (via drill 0.5)
  Top 0.305: U3.8 65.41,26.04 65.41,33.02 70.48,38.1 v70.48,40.64
  Bottom 0.305: v70.48,40.64 70.48,41.91 71.75,43.18 U11.11
N$6
  Top 0.305: 73.66,38.73 73.66,27.3 73.03,26.67 73.03,23.5 73.66,22.86 U9.10 | U11.12 73.66,38.73 | U11.8 73.66,48.9 73.66,38.73
N$7  (via drill 0.5)
  Top 0.406: R90_1/4W.1 94.61,80.64 94.61,71.12 | U3.3 71.12,12.7 72.39,13.97 72.39,19.05 73.66,20.32 U9.11 | 94.61,71.12 U5.4 | 94.61,71.12 94.61,64.77 92.08,62.23 92.08,57.78 93.34,56.52 93.34,36.2 92.08,34.92 v92.08,24.13
  Bottom 0.406: U9.11 77.47,20.32 81.28,24.13 v92.08,24.13
N$8  (via drill 0.5)
  Top 0.305: U12.6 19.05,12.06 23.5,12.06 24.77,13.34 24.77,17.14 26.04,18.41 31.75,18.41 34.29,20.95 34.29,24.77 v36.2,26.67 | v49.53,40.01 49.53,31.75 48.26,30.48 42.55,30.48 v40.64,28.57
  Bottom 0.305: U11.9 67.31,40.01 v49.53,40.01 | v40.64,28.57 36.83,28.57 36.2,27.94 v36.2,26.67
N$9
  Top 0.406: R14.2 U12.24 U12.25
N$11  (via drill 0.5)
  Top 0.305: U3.5 72.39,20.32 72.39,27.94 v71.75,28.57 | U6.5 93.98,44.45 93.98,34.92 v93.34,34.29
  Bottom 0.305: v71.75,28.57 73.03,29.84 88.9,29.84 v93.34,34.29
N$12  (via drill 0.5)
  Top 0.305: U2.5 98.42,24.77 98.42,59.69 97.16,60.96 v93.98,60.96 | U4.4 81.92,68.58 80.64,69.85 80.64,71.12 81.92,72.39 90.81,72.39 91.44,71.75 v91.44,67.31
  Bottom 0.305: v91.44,67.31 91.44,65.41 93.98,62.87 v93.98,60.96
N$13
  Bottom 0.406: U3.2 71.75,10.16 73.03,8.89 78.11,8.89 81.28,5.71 94.61,5.71 96.52,7.62 U2.1
N$14
  Bottom 0.406: U6.1 98.42,36.83 99.06,36.2 99.06,18.41 98.42,17.78 U2.3
N$15
  Top 0.305: U2.9 87,25.4 86.36,26.04 86.36,55.24 87,55.88 90.17,55.88 90.81,56.52 90.81,60.96 90.17,61.59 86.36,61.59 85.09,62.87 85.09,69.22 U4.5
N$16  (via drill 0.5)
  Top 0.305: v87.63,60.33 86.36,60.33 84.45,62.23 81.28,62.23 77.47,66.04 U4.14
  Bottom 0.305: U6.7 91.44,52.07 90.81,52.7 90.81,55.88 90.17,56.52 87.63,56.52 87,57.15 87,59.69 v87.63,60.33
N$18  (via drill 0.5)
  Top 0.305: U2.12 87,17.78 85.72,19.05 85.72,52.07 v84.45,53.34
  Bottom 0.305: U4.6 82.55,73.66 81.28,72.39 81.28,70.48 81.92,69.85 84.45,69.85 85.09,69.22 85.09,53.98 v84.45,53.34
N$35  (via drill 0.5)
  Top 0.305: U8.22 31.75,45.72 32.38,45.09 34.92,45.09 35.56,45.72 v35.56,52.07 | U6.10 92.71,48.26 92.71,36.83 90.81,34.92 v90.81,33.66 | v43.18,40.01 v43.18,57.15
  Bottom 0.305: v35.56,52.07 35.56,57.78 36.83,59.05 41.27,59.05 v43.18,57.15 | v43.18,40.01 44.45,38.73 64.14,38.73 69.22,33.66 v90.81,33.66
RD  (via drill 0.5)
  Top 0.305: v33.02,29.21 34.92,29.21 v37.47,27.3 | v46.99,26.04 48.9,26.04 50.8,24.13 U12.21
  Top 0.406: U7.22 21.59,65.41 25.4,61.59 25.4,54.61 26.67,53.34 U8.24
  Bottom 0.305: v33.02,29.21 33.02,39.37 26.67,45.72 U8.24 | v37.47,27.3 41.27,27.3 42.55,26.04 v46.99,26.04
RESET
  Top 0.305: U4.15 73.66,63.5 73.03,62.87 73.03,33.66 67.94,28.57 67.94,17.14 U3.4
  Bottom 0.406: U3.4 67.94,15.24 66.67,13.97 60.96,13.97 58.42,16.51 39.37,16.51 38.1,17.78 U12.26
TEST  (via drill 0.6)
  Top 0.305: v77.75,70 74.5,70 73.03,71.47 73.03,82.55 R13.1
  Bottom 0.305: U11.4 81.92,43.18 80.64,44.45 80.64,50.8 79.38,52.07 79.38,69.22 78.59,70 v77.75,70 | R13.1 80.76,85.72 TEST.1
WR  (via drill 0.5)
  Top 0.305: v25.4,68.58 25.4,67.31 30.48,62.23 30.48,45.09 37.47,38.1 v43.18,38.1
  Bottom 0.305: U12.22 48.26,36.83 46.99,38.1 v43.18,38.1 | v25.4,68.58 25.4,73.03 24.13,74.3 10.16,74.3 8.89,73.03 U7.27
Y3  (via drill 0.5)
  Top 0.305: v43.81,80.01 43.81,78.74 42.55,77.47 27.94,77.47 26.67,76.2 U7.20 | v85.72,71.12 87,69.85 v87,67.31
  Bottom 0.305: v43.81,80.01 44.45,79.38 52.07,79.38 56.52,83.82 71.75,83.82 74.93,80.64 83.82,80.64 85.09,79.38 85.09,71.75 v85.72,71.12 | v87,67.31 86.36,66.67 86.36,55.24 87,54.61 U6.9

### Text on the board
tPlace: 1 | 26
tNames: Raster / 0.025 inch!!!! | GND | +5V | DATA EAST 128 x 16 / DOT MATRIX DRIVER BOARD / rev. 1.0 11/2017